# Altium project ISM_FR4.PrjPcb
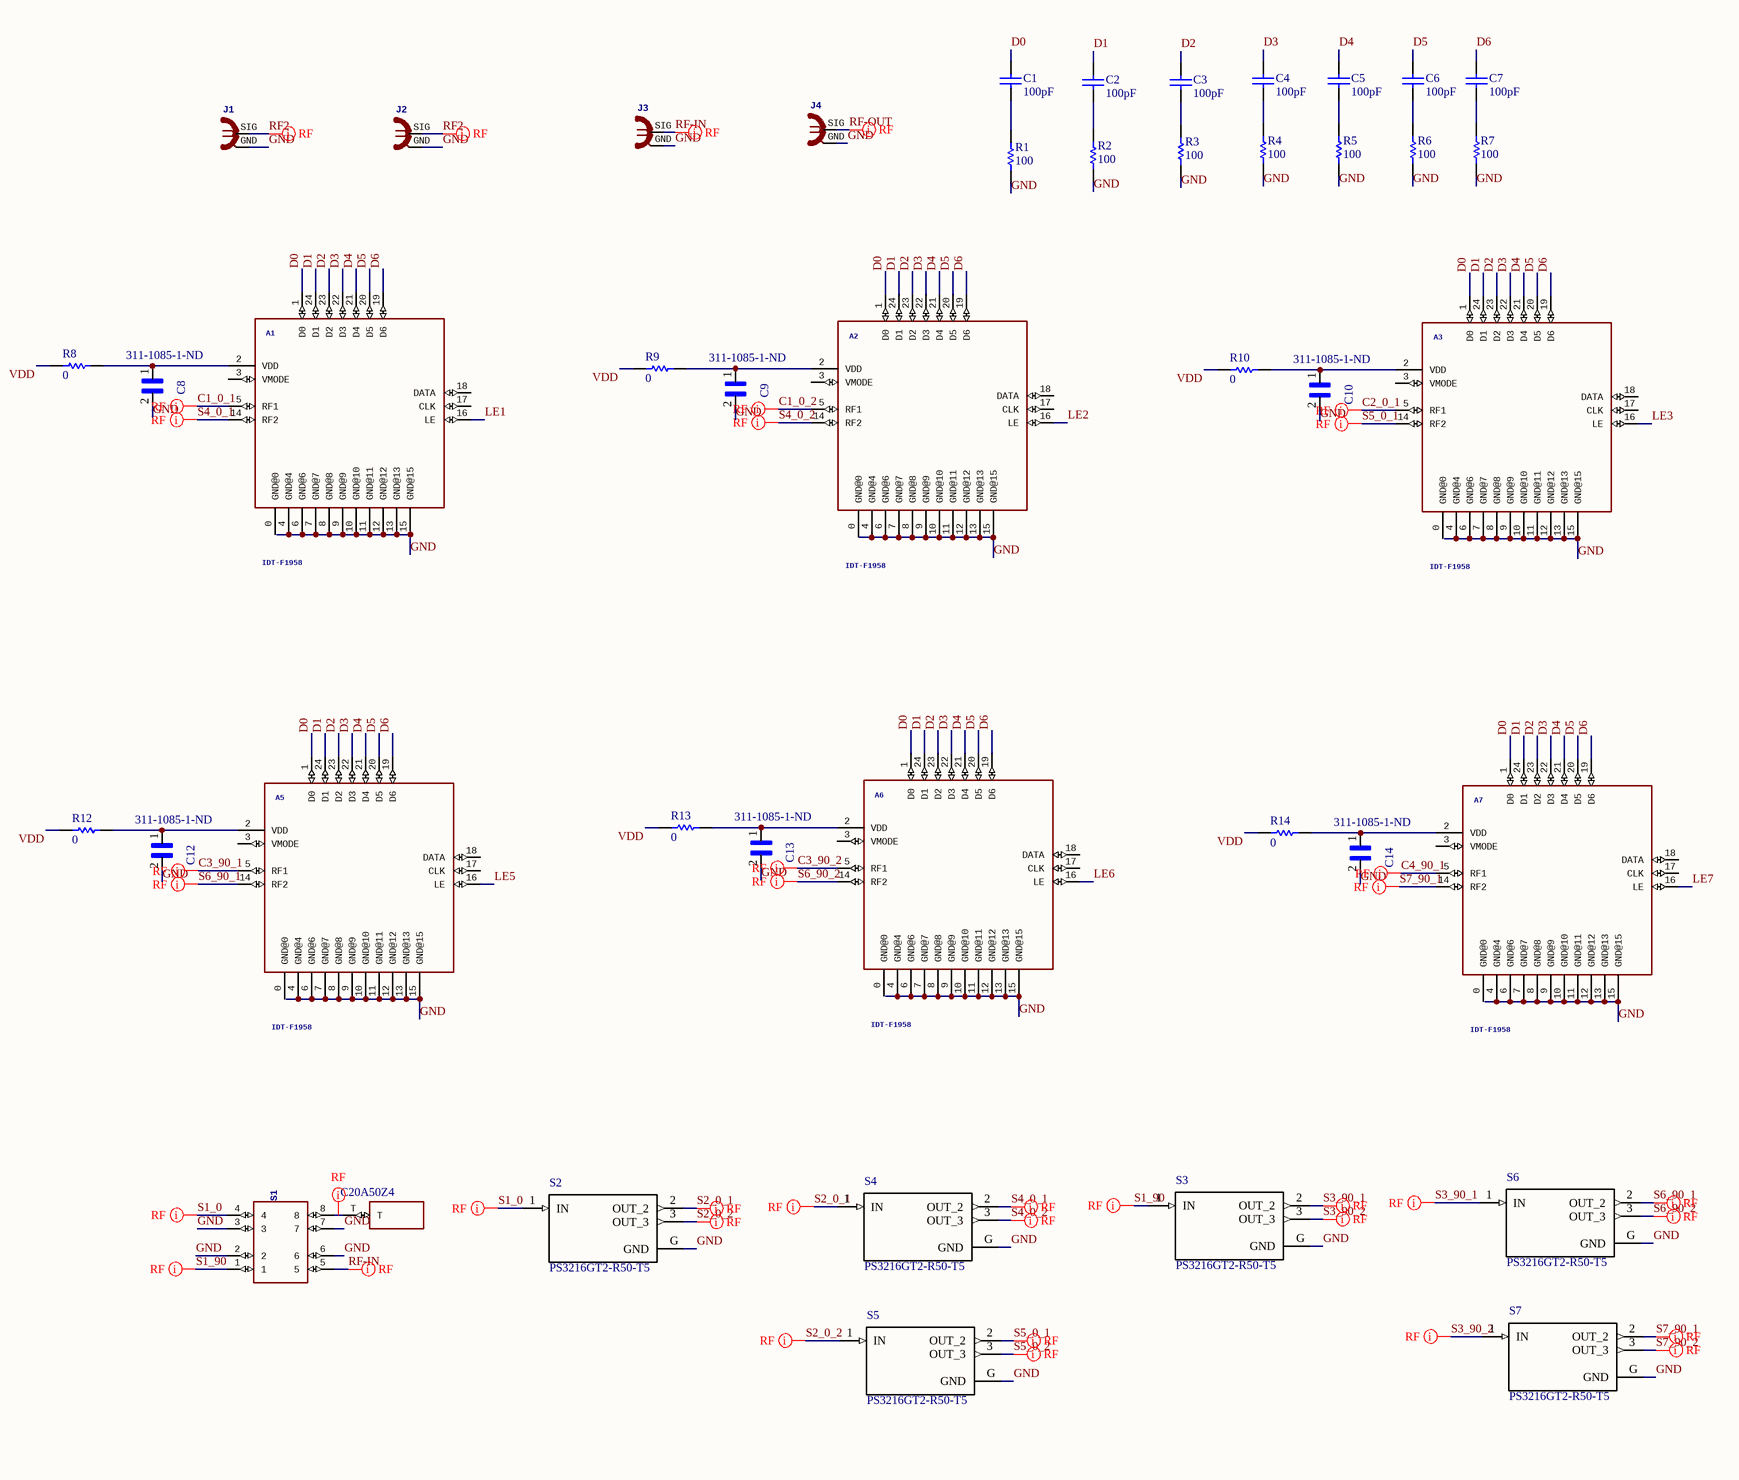
[diagram p0: v1_1_1.SchDoc, top left]
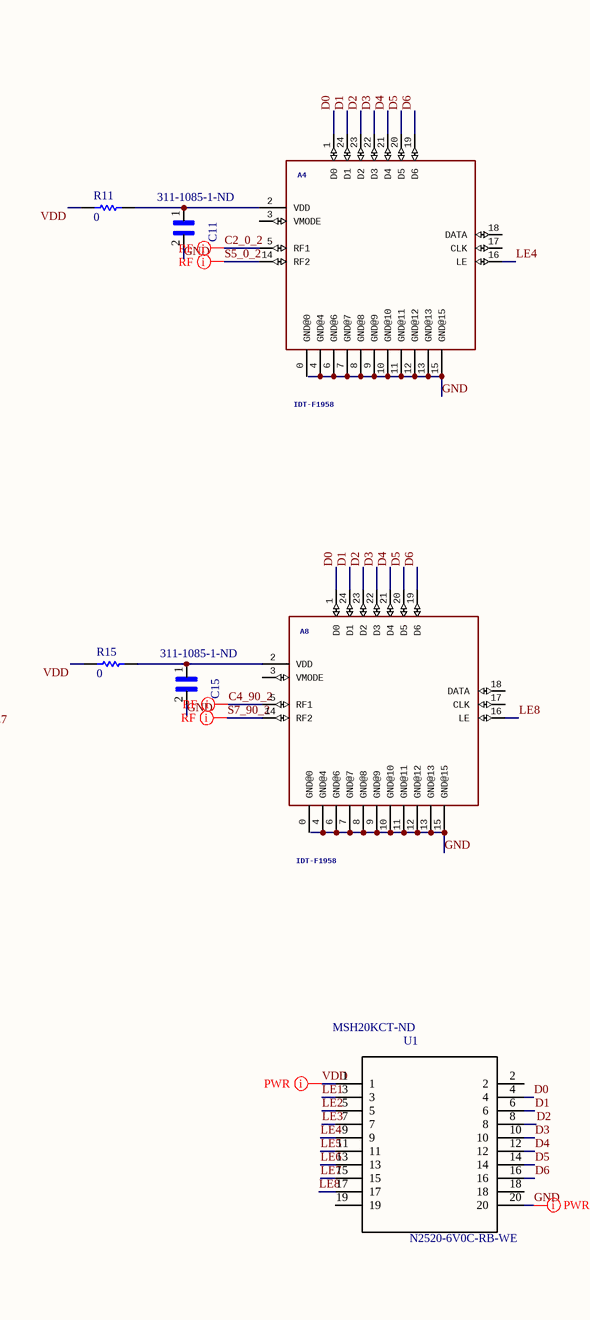
[diagram p1: v1_1_1.SchDoc, top right]
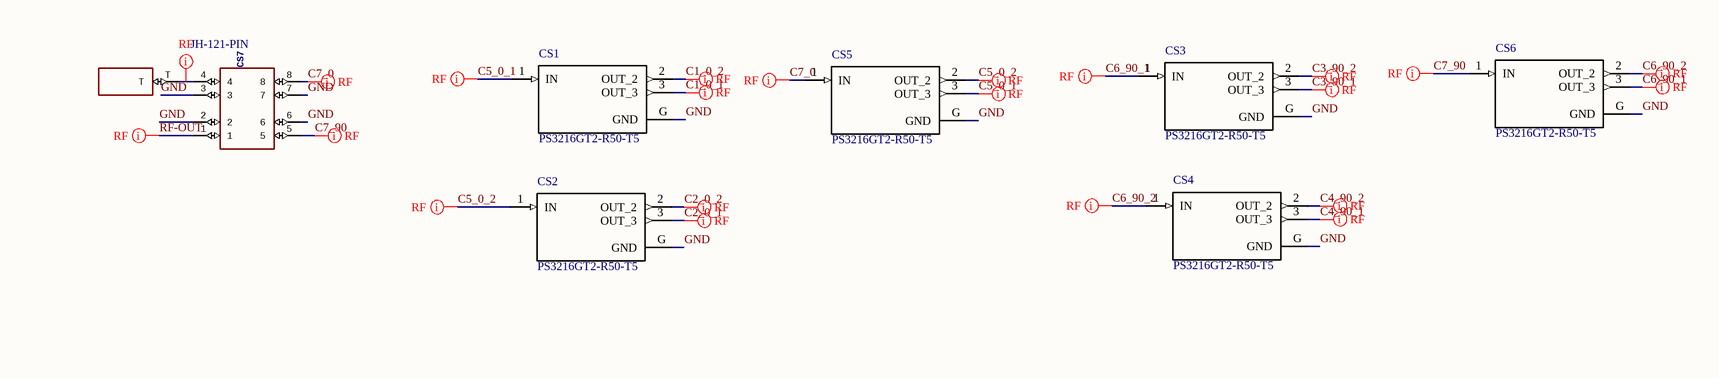
[diagram p2: v1_1_1.SchDoc, centre left]
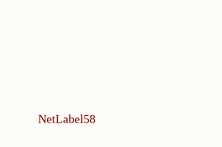
[diagram p3: v1_1_1.SchDoc, bottom left]
1 sheet, 59 parts. Net scope: global (net labels, ports and power ports of the same name join across sheets).
Board file: v1_1_1.PcbDoc

## Sheet v1_1_1.SchDoc
size OrCAD E

### Parts
A1  IDT-F1958  [VFQFPN-24]
A2  IDT-F1958  [VFQFPN-24]
A3  IDT-F1958  [VFQFPN-24]
A4  IDT-F1958  [VFQFPN-24]
A5  IDT-F1958  [VFQFPN-24]
A6  IDT-F1958  [VFQFPN-24]
A7  IDT-F1958  [VFQFPN-24]
A8  IDT-F1958  [VFQFPN-24]
C1  100pF  [CAPC1608X90X35ML15T15]
C2  100pF  [CAPC1608X90X35ML15T15]
C3  100pF  [CAPC1608X90X35ML15T15]
C4  100pF  [CAPC1608X90X35ML15T15]
C5  100pF  [CAPC1608X90X35ML15T15]
C6  100pF  [CAPC1608X90X35ML15T15]
C7  100pF  [CAPC1608X90X35ML15T15]
C8  Supplier Part Number 1: 311-1085-1-ND  [*CAPC1608X90]  (hidden comment: 10nF)
C9  Supplier Part Number 1: 311-1085-1-ND  [*CAPC1608X90]  (hidden comment: 10nF)
C10  Supplier Part Number 1: 311-1085-1-ND  [*CAPC1608X90]  (hidden comment: 10nF)
C11  Supplier Part Number 1: 311-1085-1-ND  [*CAPC1608X90]  (hidden comment: 10nF)
C12  Supplier Part Number 1: 311-1085-1-ND  [*CAPC1608X90]  (hidden comment: 10nF)
C13  Supplier Part Number 1: 311-1085-1-ND  [*CAPC1608X90]  (hidden comment: 10nF)
C14  Supplier Part Number 1: 311-1085-1-ND  [*CAPC1608X90]  (hidden comment: 10nF)
C15  Supplier Part Number 1: 311-1085-1-ND  [*CAPC1608X90]  (hidden comment: 10nF)
CS1  PS3216GT2-R50-T5  [*SUSUMU_PS3216GT2-R50-T5_PS3216GT2-R50-T5(Primary)]
CS2  PS3216GT2-R50-T5  [*SUSUMU_PS3216GT2-R50-T5_PS3216GT2-R50-T5(Primary)]
CS3  PS3216GT2-R50-T5  [*SUSUMU_PS3216GT2-R50-T5_PS3216GT2-R50-T5(Primary)]
CS4  PS3216GT2-R50-T5  [*SUSUMU_PS3216GT2-R50-T5_PS3216GT2-R50-T5(Primary)]
CS5  PS3216GT2-R50-T5  [*SUSUMU_PS3216GT2-R50-T5_PS3216GT2-R50-T5(Primary)]
CS6  PS3216GT2-R50-T5  [*SUSUMU_PS3216GT2-R50-T5_PS3216GT2-R50-T5(Primary)]
CS7  JH-121-PIN  [FP-2]
J1  SMA 50 Ohm edge  [SMA-OSHPARK-4L-1.6MM]  (value not drawn)
J2  SMA 50 Ohm edge  [SMA-OSHPARK-4L-1.6MM]  (value not drawn)
J3  SMA 50 Ohm edge  [SMA-OSHPARK-4L-1.6MM]  (value not drawn)
J4  SMA 50 Ohm edge  [SMA-OSHPARK-4L-1.6MM]  (value not drawn)
R1  100  [RESC1608X55X30LL20T20]
R2  100  [RESC1608X55X30LL20T20]
R3  100  [RESC1608X55X30LL20T20]
R4  100  [RESC1608X55X30LL20T20]
R5  100  [RESC1608X55X30LL20T20]
R6  100  [RESC1608X55X30LL20T20]
R7  100  [RESC1608X55X30LL20T20]
R8  0  [RESC1608X55X30NL15T15]
R9  0  [RESC1608X55X30NL15T15]
R10  0  [RESC1608X55X30NL15T15]
R11  0  [RESC1608X55X30NL15T15]
R12  0  [RESC1608X55X30NL15T15]
R13  0  [RESC1608X55X30NL15T15]
R14  0  [RESC1608X55X30NL15T15]
R15  0  [RESC1608X55X30NL15T15]
S1  JH-121-PIN  [FP-2]  (value not drawn)
S2  PS3216GT2-R50-T5  [*SUSUMU_PS3216GT2-R50-T5_PS3216GT2-R50-T5(Primary)]
S3  PS3216GT2-R50-T5  [*SUSUMU_PS3216GT2-R50-T5_PS3216GT2-R50-T5(Primary)]
S4  PS3216GT2-R50-T5  [*SUSUMU_PS3216GT2-R50-T5_PS3216GT2-R50-T5(Primary)]
S5  PS3216GT2-R50-T5  [*SUSUMU_PS3216GT2-R50-T5_PS3216GT2-R50-T5(Primary)]
S6  PS3216GT2-R50-T5  [*SUSUMU_PS3216GT2-R50-T5_PS3216GT2-R50-T5(Primary)]
S7  PS3216GT2-R50-T5  [*SUSUMU_PS3216GT2-R50-T5_PS3216GT2-R50-T5(Primary)]
T1  C20A50Z4  [C20A50Z4]
T2  C20A50Z4  [C20A50Z4]  (value not drawn)
U1  N2520-6V0C-RB-WE  Supplier Part Number 1: MSH20KCT-ND  [*3M_N2520-6V0C-RB-WE]

### Nets
C1_0_1: A1.5(RF1) CS1.3(OUT_3)
C1_0_2: A2.5(RF1) CS1.2(OUT_2)
C2_0_1: A3.5(RF1) CS2.3(OUT_3)
C2_0_2: A4.5(RF1) CS2.2(OUT_2)
C3_90_1: A5.5(RF1) CS3.3(OUT_3)
C3_90_2: A6.5(RF1) CS3.2(OUT_2)
C4_90_1: A7.5(RF1) CS4.3(OUT_3)
C4_90_2: A8.5(RF1) CS4.2(OUT_2)
C5_0_1: CS1.1(IN) CS5.3(OUT_3)
C5_0_2: CS2.1(IN) CS5.2(OUT_2)
C6_90_1: CS3.1(IN) CS6.3(OUT_3)
C6_90_2: CS4.1(IN) CS6.2(OUT_2)
C7_0: CS5.1(IN) CS7.8
C7_90: CS6.1(IN) CS7.5
D0: A1.1(D0) A2.1(D0) A3.1(D0) A4.1(D0) A5.1(D0) A6.1(D0) A7.1(D0) A8.1(D0) C1.2 U1.4
D1: A1.24(D1) A2.24(D1) A3.24(D1) A4.24(D1) A5.24(D1) A6.24(D1) A7.24(D1) A8.24(D1) C2.2 U1.6
D2: A1.23(D2) A2.23(D2) A3.23(D2) A4.23(D2) A5.23(D2) A6.23(D2) A7.23(D2) A8.23(D2) C3.2 U1.8
D3: A1.22(D3) A2.22(D3) A3.22(D3) A4.22(D3) A5.22(D3) A6.22(D3) A7.22(D3) A8.22(D3) C4.2 U1.10
D4: A1.21(D4) A2.21(D4) A3.21(D4) A4.21(D4) A5.21(D4) A6.21(D4) A7.21(D4) A8.21(D4) C5.2 U1.12
D5: A1.20(D5) A2.20(D5) A3.20(D5) A4.20(D5) A5.20(D5) A6.20(D5) A7.20(D5) A8.20(D5) C6.2 U1.14
D6: A1.19(D6) A2.19(D6) A3.19(D6) A4.19(D6) A5.19(D6) A6.19(D6) A7.19(D6) A8.19(D6) C7.2 U1.16
GND: A1.4(GND@4) A1.6(GND@6) A1.7(GND@7) A1.8(GND@8) A1.9(GND@9) A1.10(GND@10) A1.11(GND@11) A1.12(GND@12) A1.13(GND@13) A1.15(GND@15) A2.4(GND@4) A2.6(GND@6) A2.7(GND@7) A2.8(GND@8) A2.9(GND@9) A2.10(GND@10) A2.11(GND@11) A2.12(GND@12) A2.13(GND@13) A2.15(GND@15) A3.4(GND@4) A3.6(GND@6) A3.7(GND@7) A3.8(GND@8) A3.9(GND@9) A3.10(GND@10) A3.11(GND@11) A3.12(GND@12) A3.13(GND@13) A3.15(GND@15) A4.4(GND@4) A4.6(GND@6) A4.7(GND@7) A4.8(GND@8) A4.9(GND@9) A4.10(GND@10) A4.11(GND@11) A4.12(GND@12) A4.13(GND@13) A4.15(GND@15) A5.4(GND@4) A5.6(GND@6) A5.7(GND@7) A5.8(GND@8) A5.9(GND@9) A5.10(GND@10) A5.11(GND@11) A5.12(GND@12) A5.13(GND@13) A5.15(GND@15) A6.4(GND@4) A6.6(GND@6) A6.7(GND@7) A6.8(GND@8) A6.9(GND@9) A6.10(GND@10) A6.11(GND@11) A6.12(GND@12) A6.13(GND@13) A6.15(GND@15) A7.4(GND@4) A7.6(GND@6) A7.7(GND@7) A7.8(GND@8) A7.9(GND@9) A7.10(GND@10) A7.11(GND@11) A7.12(GND@12) A7.13(GND@13) A7.15(GND@15) A8.4(GND@4) A8.6(GND@6) A8.7(GND@7) A8.8(GND@8) A8.9(GND@9) A8.10(GND@10) A8.11(GND@11) A8.12(GND@12) A8.13(GND@13) A8.15(GND@15) C8.2 C9.2 C10.2 C11.2 C12.2 C13.2 C14.2 C15.2 CS1.G(GND) CS2.G(GND) CS3.G(GND) CS4.G(GND) CS5.G(GND) CS6.G(GND) CS7.2 CS7.3 CS7.6 CS7.7 J1.GND J2.GND J3.GND J4.GND R1.2 R2.2 R3.2 R4.2 R5.2 R6.2 R7.2 S1.2 S1.3 S1.6 S1.7 S2.G(GND) S3.G(GND) S4.G(GND) S5.G(GND) S6.G(GND) S7.G(GND) U1.20
LE1: A1.16(LE) U1.3
LE2: A2.16(LE) U1.5
LE3: A3.16(LE) U1.7
LE4: A4.16(LE) U1.9
LE5: A5.16(LE) U1.11
LE6: A6.16(LE) U1.13
LE7: A7.16(LE) U1.15
LE8: A8.16(LE) U1.17
RF2: J1.SIG J2.SIG
RF-IN: J3.SIG S1.5
RF-OUT: CS7.1 J4.SIG
S1_0: S1.4 S2.1(IN)
S1_90: S1.1 S3.1(IN)
S2_0_1: S2.2(OUT_2) S4.1(IN)
S2_0_2: S2.3(OUT_3) S5.1(IN)
S3_90_1: S3.2(OUT_2) S6.1(IN)
S3_90_2: S3.3(OUT_3) S7.1(IN)
S4_0_1: A1.14(RF2) S4.2(OUT_2)
S4_0_2: A2.14(RF2) S4.3(OUT_3)
S5_0_1: A3.14(RF2) S5.2(OUT_2)
S5_0_2: A4.14(RF2) S5.3(OUT_3)
S6_90_1: A5.14(RF2) S6.2(OUT_2)
S6_90_2: A6.14(RF2) S6.3(OUT_3)
S7_90_1: A7.14(RF2) S7.2(OUT_2)
S7_90_2: A8.14(RF2) S7.3(OUT_3)
VDD: R8.1 R9.1 R10.1 R11.1 R12.1 R13.1 R14.1 R15.1 U1.1
NetA1_2: A1.2(VDD) C8.1 R8.2
NetA2_2: A2.2(VDD) C9.1 R9.2
NetA3_2: A3.2(VDD) C10.1 R10.2
NetA4_2: A4.2(VDD) C11.1 R11.2
NetA5_2: A5.2(VDD) C12.1 R12.2
NetA6_2: A6.2(VDD) C13.1 R13.2
NetA7_2: A7.2(VDD) C14.1 R14.2
NetA8_2: A8.2(VDD) C15.1 R15.2
NetC1_1: C1.1 R1.1
NetC2_1: C2.1 R2.1
NetC3_1: C3.1 R3.1
NetC4_1: C4.1 R4.1
NetC5_1: C5.1 R5.1
NetC6_1: C6.1 R6.1
NetC7_1: C7.1 R7.1
NetCS7_4: CS7.4 T2.T
NetS1_8: S1.8 T1.T

Not connected (* = marked no-connect by the designer): A1 0(GND@0) 3(VMODE) 17(CLK) 18(DATA); A2 0(GND@0) 3(VMODE) 17(CLK) 18(DATA); A3 0(GND@0) 3(VMODE) 17(CLK) 18(DATA); A4 0(GND@0) 3(VMODE) 17(CLK) 18(DATA); A5 0(GND@0) 3(VMODE) 17(CLK) 18(DATA); A6 0(GND@0) 3(VMODE) 17(CLK) 18(DATA); A7 0(GND@0) 3(VMODE) 17(CLK) 18(DATA); A8 0(GND@0) 3(VMODE) 17(CLK) 18(DATA); U1 2 18 19

### Layout directives
rule Clearance Constraint [Generic clearance = 10mil, and 14 value(s) for objects]; rule Width Constraint [Pref Width = 10mil    Min Width = 5.78mil    Max Width = 10mil]: C1_0_1, C1_0_2, C2_0_1, C2_0_2, C3_90_1, C3_90_2, C4_90_1, C4_90_2, C5_0_1, C5_0_2, C6_90_1, C6_90_2, C7_0, C7_90, NetCS7_4, NetS1_8, RF2, RF-IN, RF-OUT, S1_0, S1_90, S2_0_1, S2_0_2, S3_90_1, S3_90_2, S4_0_1, S4_0_2, S5_0_1, S5_0_2, S6_90_1, S6_90_2, S7_90_1, S7_90_2
rule Clearance Constraint [Generic clearance = 10mil, and 14 value(s) for objects]; rule Width Constraint [Pref Width = 10mil    Min Width = 10mil    Max Width = 16mil]: GND, VDD

### Notes on the sheet
- Labels drawn without touching a wire or pin: NetLabel58

### Library data of the parts
A1-A8 = IDT-F1958: GateName_1: G$1; SymbolName_1: F1958; LibraryName: wcsn_parts; DeviceSetName: IDT-F1958; Package: VFQFPN-24
C1-C7 = CMP-2000-05011-1: CAP, 100pF, 50VDC, +-5%, 0603, CERAMIC MONOLITHIC CHIP, LF; Manufacturer: AVX; Package Description: 2-Pin Surface Mount Device, Body 1.6 x 0.81 mm; Manufacturer URL: http://www.avx.com/; Package Reference: 603; Datasheet URL: http://datasheet.octopart.com/06035A101JAT2A-AVX-datasheet-9883399.pdf; Datasheet Version: Nov-10
C8-C15 = CC0603KRX7R9BB103: Cap Cer 10000pf 50v 10% X7r 0603 Cap Cer 10000pf 50v 10% X7r 0603 Cap Cer 10000pf 50v 10% X7r 0603; MF: Yageo; Digi-Key_Part_Number: 311-1085-1-ND; SnapEDA_Link: https://www.snapeda.com/parts/CC0603KRX7R9BB103/Yageo/view-part/?ref=snap; Digi-Key_Purchase_URL: https://www.digikey.com/product-detail/en/yageo/CC0603KRX7R9BB103/311-1085-1-ND/302995?utm_source=snapeda&utm_medium=aggregator&utm_campaign=symbol; Package: 0603 Yageo; MP: CC0603KRX7R9BB103; Value: *; Supplier 1: Digi-Key
CS1-CS6 S2-S7 = PS3216GT2-R50-T5: Power Divider 6db .25w 1206 Smd; MF: Susumu; Availability: Unavailable; SnapEDA_Link: https://www.snapeda.com/parts/PS3216GT2-R50-T5/Susumu/view-part/?ref=snap; Price: None; Package: 1206 Susumu; MP: PS3216GT2-R50-T5; Value: *
CS7 S1 = JH-121-PIN: GateName_1: G$1; SymbolName_1: JH-121-PIN; LibraryName: wcsn_parts; DeviceSetName: JH-121-PIN; Package: FP-2
  CS7: Supplier 1: Richardson RFPD; Supplier Part Number 1: JH-121-PIN
J1-J4 = SMA-OSHPARK-4L-1.6MM: GateName_1: G1; SymbolName_1: COAX; DeviceName: -OSHPARK-4L-1.6MM; LibraryName: dword1511-connectors; DeviceSetName: SMA; Package: SMA-OSHPARK-4L-1.6MM
R1-R7 = CMP-2000-00870-1: Part Number: ERA3AEB101V; Manufacturer: Panasonic
R8-R15 = CMP-2000-00700-1: Manufacturer: Panasonic; Part Number: ERJ-3GEY0R00V
T1 T2 = C20A50Z4: GateName_1: G$1; SymbolName_1: RF-TERMINATION; LibraryName: wcsn_parts; DeviceSetName: C20A50Z4; Package: C20A50Z4
  T1: Supplier 1: Richardson RFPD; Supplier Part Number 1: C20A50Z4
U1 = N2520-6V0C-RB-WE: 2500 Series Low Profile SMT 4 wall Header, Straight, .100 X .100 20 Position; MF: 3M; Package: None; Digi-Key_Part_Number: MSH20KCT-ND; Digi-Key_Purchase_URL: https://www.digikey.com/product-detail/en/3m/N2520-6V0C-RB-WE/MSH20KCT-ND/1125449?utm_source=snapeda&utm_medium=aggregator&utm_campaign=symbol; SnapEDA_Link: https://www.snapeda.com/parts/N2520-6V0C-RB-WE/3M%20%28TC%29/view-part/?ref=snap; MP: N2520-6V0C-RB-WE; Value: *; Supplier 1: Digi-Key

## Assembly variants
V1.1.1 8 Att: all parts fitted
V2 ISOLA: all parts fitted